# Altium schematic sheet Ups chg.SchDoc
size A4; SheetNumber: 1; SheetTotal: 1
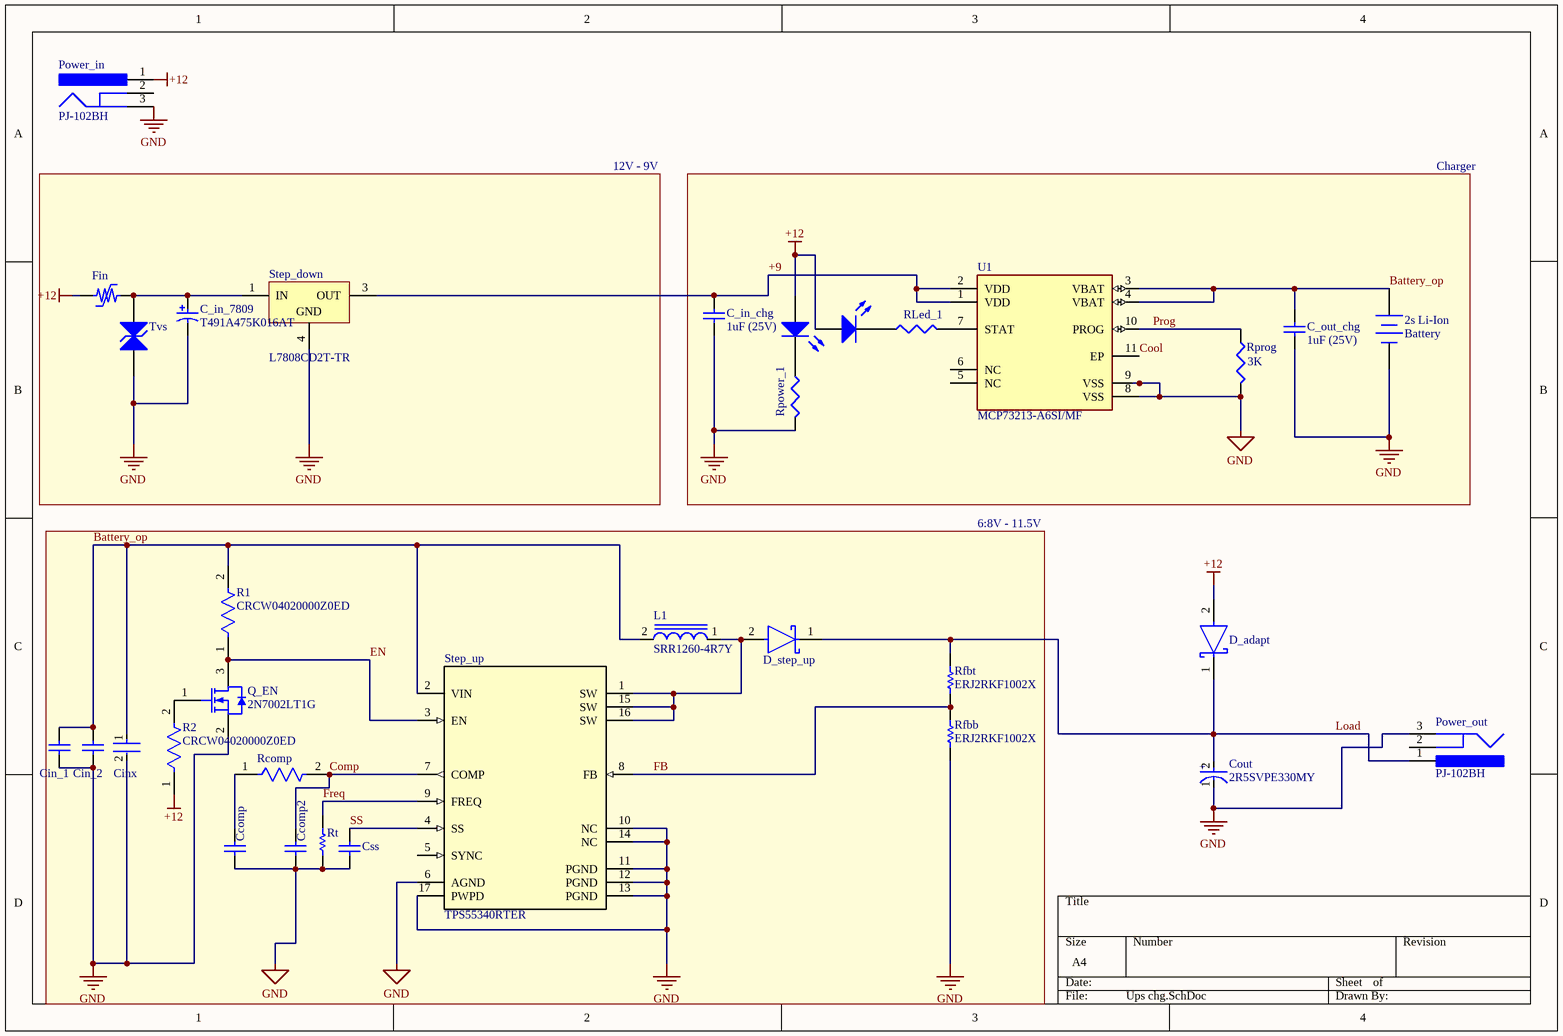
[diagram p0: Ups chg.SchDoc]

## Parts
2s_Li-Ion  Battery  [BAT-2]
C_in_7809  T491A475K016AT  [KEMT-A-3216-18-2_L]
C_in_chg  1uF (25V)  [CAPC2013X140X50LL20T25]
C_out_chg  1uF (25V)  [CAPC2013X140X50LL20T25]
Ccomp  06035C102KAT2A  [CAPC1608X90X35LL15T15]  (value not drawn)
Ccomp2  06035C102KAT2A  [CAPC1608X90X35LL15T15]  (value not drawn)
Cin_1  C1206C106K4RACTU  [CAPC3216X180X50ML20T25]  (value not drawn)
Cin_2  C1206C106K4RACTU  [CAPC3216X180X50ML20T25]  (value not drawn)
Cinx  C0805C104M5RACTU  [FP-C0805C-DN-MFG]  (value not drawn)
Cout  2R5SVPE330MY  [FP-SVPE-B6-MFG]
Css  06035C102KAT2A  [CAPC1608X90X35LL15T15]  (value not drawn)
D_adapt  B540C-13-F  [FP-SMC-MFG]  (value not drawn)
D_chg  LED1  [LED-1]  (value not drawn)
D_step_up  B540C-13-F  [FP-SMC-MFG]  (value not drawn)
Fin  MF-MSMF075-2  [BOUR-MF-MSMF050-2_V]  (value not drawn)
L1  SRR1260-4R7Y  [INDP125125X600N]
Power_Good  LED1  [LED-1]  (value not drawn)
Power_in  PJ-102BH  [CUI-PJ-102BH_V]
Power_out  PJ-102BH  [CUI-PJ-102BH_V]
Q_EN  2N7002LT1G  [ONSC-SOT-23-3-318-08_V]
R1  CRCW04020000Z0ED  [FP-CRCW0402-e3-IPC_C]
R2  CRCW04020000Z0ED  [FP-CRCW0402-e3-IPC_C]
Rcomp  CRCW04020000Z0ED  [FP-CRCW0402-e3-IPC_C]  (value not drawn)
Rfbb  ERJ2RKF1002X  [RESC1005X40X25LL05T05]
Rfbt  ERJ2RKF1002X  [RESC1005X40X25LL05T05]
RLed_1  1K  [J1-0603]  (value not drawn)
Rpower_1  1K  [J1-0603]  (value not drawn)
Rprog  3K  [J1-0603]
Rt  CRCW08050000Z0EA  [RESC2013X50X30LL20T20]  (value not drawn)
Step_down  L7808CD2T-TR  [TO-263_N]
Step_up  TPS55340RTER  [RTE0016C]
Tvs  SMAJ14CA-E3/61  [VISH-DO-214AC-2_N]  (value not drawn)
U1  MCP73213-A6SI/MF  [FP-C04-063-MFG]

## Blocks framed on the sheet
12V - 9V: C_in_7809 Fin Step_down Tvs
Charger: 2s_Li-Ion C_in_chg C_out_chg D_chg Power_Good RLed_1 Rpower_1 Rprog U1
6:8V - 11.5V: Ccomp Ccomp2 Cin_1 Cin_2 Cinx Css D_step_up L1 Q_EN R1 R2 Rcomp Rfbb Rfbt Rt Step_up

## Nets
+12: D_adapt.2(A) D_chg.1(A) Fin.1 Power_Good.1(A) Power_in.1 R2.1
GND: 2s_Li-Ion.2(-) C_in_7809.2 C_in_chg.1 C_out_chg.1 Ccomp.1 Ccomp2.1 Cin_1.1 Cin_2.1 Cinx.2 Cout.1(C) Css.1 Power_in.3 Power_out.3 Q_EN.2(S) Rfbb.1 Rpower_1.2 Rprog.2 Rt.1 Step_down.4(GND) Step_up.6(AGND) Step_up.10(NC) Step_up.11(PGND) Step_up.12(PGND) Step_up.13(PGND) Step_up.14(NC) Step_up.17(PWPD) Tvs.1(A1) U1.8(VSS) U1.9(VSS)
+9: C_in_chg.2 Step_down.3(OUT) U1.1(VDD) U1.2(VDD)
Battery_op: 2s_Li-Ion.1(+) C_out_chg.2 Cin_1.2 Cin_2.2 Cinx.1 L1.2 R1.2 Step_up.2(VIN) U1.3(VBAT) U1.4(VBAT)
Comp: Ccomp2.2 Rcomp.2 Step_up.7(COMP)
Cool: U1.11(EP)
EN: Q_EN.3(D) R1.1 Step_up.3(EN)
FB: Rfbb.2 Rfbt.1 Step_up.8(FB)
Freq: Rt.2 Step_up.9(FREQ)
Load: Cout.2(A) D_adapt.1(C) D_step_up.1(C) Power_out.1 Rfbt.2
Prog: Rprog.1 U1.10(PROG)
SS: Css.2 Step_up.4(SS)
NetC_in_7809_1: C_in_7809.1 Fin.2 Step_down.1(IN) Tvs.2(A2)
NetCcomp_2: Ccomp.2 Rcomp.1
NetD_chg_2: D_chg.2(K) RLed_1.1
NetD_step_up_2: D_step_up.2(A) L1.1 Step_up.1(SW) Step_up.15(SW) Step_up.16(SW)
NetPower_Good_2: Power_Good.2(K) Rpower_1.1
NetQ_EN_1: Q_EN.1(G) R2.2
NetRLed_1_2: RLed_1.2 U1.7(STAT)

Not connected (* = marked no-connect by the designer): Power_in 2; Power_out 2; Step_up 5(SYNC); U1 5(NC) 6(NC)

## Notes on the sheet
- (in symbol CMP-05428-000004-1) +

## Library data of the parts
2s_Li-Ion = Battery: Multicell Battery; Published: 24-Mar-1999; LatestRevisionDate: 17-Jul-2002; LatestRevisionNote: Re-released for DXP Platform.; PackageReference: BAT-2; Publisher: Altium Limited; PackageDescription: Battery; 2 Leads
C_in_7809 = CMP-2000-07188-1: Tantalum Capacitor, 4.7 uF, +/- 10%, 16 V, -55 to 125 degC, 2-Pin Molded, RoHS, Tape and Reel; Manufacturer: Kemet; Capacity (elec.): 4.7µF; Nominal voltage: 16V; Content: 1pc(s); Type: T491A475K016AT; Tolerance: 10%; Mounting Technology: SurfaceMount; Package Reference: 1206; Datasheet URL: https://datasheet.ciiva.com/11793/0900766b80718482-11793043.pdf; Manufacturer URL: http://www.kemet.com/; Package Description: 2-Pin Surface Mount Device, Body 3.2 x 1.6 mm; Category: Tantalumcapacitor; Datasheet Version: 08/2014
C_in_chg C_out_chg = CMP-2007-03234-1: Part Number: C0805C105K3RACTU; Manufacturer: Kemet
Ccomp Ccomp2 Css = CMP-2006-04378-1: Manufacturer: AVX Interconnect / Elco; Part Number: 06035C102KAT2A
Cin_1 Cin_2 = CMP-1664-00006-1: CAP, Ceramic, 10 uF, +/- 10%, 16 V, -55 to 125 degC, 1206 (3216 Metric), RoHS, Tape and Reel; Voltage Rating: 50 V; Case\Package: 0603; Type (Capacitors): C0G; Tolerance: 5%; Capacitance: 8.2 pF; Length: 1.6 mm; Mount: Surface Mount; Radiation Hardening: No; Height: 0.8 mm; RoHSCompliant: true; ComponentLink1URL: http://www.kemet.com/; REACH SVHC: No SVHC; ComponentLink1Description: Manufacturer URL; ComponentLink2Description: Datasheet; ComponentLink2URL: http://capacitoredge.kemet.com/capedge2/DataSheet/Datasheet-C1206C106K4RACTU.pdf?pn=C1206C106K4RACTU; Width: 0.8 mm; Packaging: Tape and Reel; Min Operating Temperature: -55 degC; Voltage Rating (DC): 50 V; Pins: 2; Max Operating Temperature: 125 degC; Case Code (Imperial): 0603; PackageDescription: 2-Pin Surface Mount Device, Body 3.2 x 1.6 mm; DatasheetVersion: Aug-16; Package Quantity: 4000; PackageReference: 1206; Case Code (Metric): 1608
Cinx = CMP-1036-04423-3: CAP CER 0.1UF 50V X7R 0805; Manufacturer: KEMET; Tolerance: 0.2; Temperature Coefficient: 30ppm/°C; Capacitance: 0.10 μF; Value: 0.10 μF; Temperature: -55°C to +125°C; RoHS: TRUE; Temperature Range Low: -55°C; Device Class L3: Ceramic Capacitors; Manufacturer Part Number: C0805C104M5RACTU; Octopart: https://octopart.com/c0805c104m5ractu-kemet-129379; Ipc Land Pattern Name: CAPC200125X78; Mouser Description: Multilayer Ceramic Capacitors MLCC - SMD/SMT 50volts 0.1uF X7R 20%; Temperature Range High: +125°C; Material: Ceramic; Package: C0805C-DN; Temperature Characteristic: X7R; Automotive: No; ComponentLink2URL: https://content.kemet.com/datasheets/KEM_C1003_C0G_SMD.pdf; Device Class L1: Passive Components; ComponentLink2Description: Datasheet; Device Class L2: Capacitors; Voltage Rating: 50 V; Digikey Description: CAP CER 0.1UF 50V X7R 0805; Lead Free: Yes; Height: 0.88mm; Category: Cap
Cout = CMP-05428-000004-1: CAP ALUM POLY 330UF 20% 2.5V SMD; Manufacturer: Panasonic; Leakage Current: 500uA; Dissipation Factor: 12%; Esr: 10mΩ; Life: 2000Hours; Ripple Current: 3860mA; Height: 6mm; Mouser Description: Cap Aluminum Polymer 330uF 2.5VDC 20% (5 X 5.9mm) SMD 0.01 Ohm 3860mA 2000h 105C T/R; ComponentLink2Description: Datasheet; Material: Polymer; Category: Cap; Device Class L3: Polymer Capacitors; Footprint Url: https://industrial.panasonic.com/cdbs/www-data/pdf/AAB8000/AAB8000COL10.pdf; Package: SVPE-B6; ComponentLink2URL: https://industrial.panasonic.com/cdbs/www-data/pdf/AAB8000/AAB8000C179.pdf; Value: 330uF; Temperature: -55°C to +105°C; Octopart: https://octopart.com/2r5svpe330my-panasonic-29498404; Temperature Range High: +105°C; Automotive: No; Device Class L2: Capacitors; Tolerance: 20%; Manufacturer Part Number: 2R5SVPE330MY; Digikey Description: CAP ALUM POLY 330UF 20% 2.5V SMD; Device Class L1: Passive Components; Voltage Rating: 2.5V; Capacitance: 330uF; Lead Free: Yes; RoHS: TRUE; Temperature Range Low: -55°C
D_adapt D_step_up = CMP-2000-05097-3: DIODE SCHOTTKY 40V 5A SMC; Manufacturer: Diodes Inc.; Automotive Grade: NA; Peak Reverse Current: 0.5mA; Value: 300pF; Max Junction Temp: +150°C; Max Surge Forward Current: 100A; Standoff Height: 0.1mm; Digikey Description: DIODE SCHOTTKY 40V 5A SMC; Temperature Range Low: -55°C; Manufacturer Part Number: B540C-13-F; Octopart: https://octopart.com/b540c-13-f-diodes+inc.-325873; Lead Free: Yes; Reverse Voltage: 40V; RoHS: TRUE; Category: Diode; Mouser Description: Diode: Schottky rectifying; SMD; 40V; 5A; SMC; Package: reel, tape; ComponentLink2Description: Datasheet; Temperature Range High: +150°C; Automotive: No; Footprint Url: https://www.diodes.com/assets/Package-Files/SMC.pdf; Device Class L3: Schottky Diodes; Height: 2.5mm; Forward Current: 5A; Temperature: -55°C to +150°C; Package: SMC; ComponentLink2URL: https://www.diodes.com/assets/Datasheets/ds13012.pdf; Device Class L2: Diodes; Max Repetitive Reverse Voltage: 40V; Device Class L1: Discrete Semiconductors; Capacitance: 300pF
D_chg Power_Good = LED1: Typical RED GaAs LED; Published: 8-Jun-2000; LatestRevisionDate: 08-Jul-2005; LatestRevisionNote: Mech Layer 1 removed.; PackageReference: LED-1; Publisher: Altium Limited; PackageDescription: LED; 2 Leads
Fin = CMP-2100-03654-1: PTC Resettable Fuse, 13.2 V, 750 mA, -40 to 85 degC, 2-Pin SMD, RoHS, Tape and Reel; Manufacturer: Bourns; Voltage Rating: 13.2V; Resistance: 450mOhm; Max Current Rating: 100A; Power Dissipation: 800mW; RoHSCompliant: true; Package Quantity: 2000; Manufacturer URL: http://www.bourns.com/; Max Operating Temperature: 85degC; Datasheet URL: http://www.bourns.com/docs/Product-Datasheets/mfmsmf.pdf; Mount: SurfaceMount; Case Code (Imperial): 1812; Width: 3.41mm; REACH SVHC: NoSVHC; Datasheet Version: Rev. AG, 08/2016; Packaging: TapeandReel; Lead Free: LeadFree; Height: 0.85mm; Current Rating: 100A; Min Operating Temperature: -40degC; Voltage Rating (DC): 13.2V; Case/Package: 1812; Termination: SMD/SMT; Radiation Hardening: No; Case Code (Metric): 4532; Supply Voltage: 13.2V; Package Reference: MF-MSMF050-2; Number of Terminals: 2; Length: 4.73mm; Package Description: 2-Pin Surface Mount Device, Body 4.55 x 3.24 mm
L1 = SRR1260-4R7Y: 4.7ÂµH Shielded Wirewound Inductor 6.8A 15.5mOhm Max Nonstandard; MF: Bourns; MP: SRR1260-4R7Y; Purchase-URL: https://pricing.snapeda.com/search/part/SRR1260-4R7Y/?ref=eda; SnapEDA_Link: https://www.snapeda.com/parts/SRR1260-4R7Y/Bourns/view-part/587861/?ref=snap; Price: None; Package: Nonstandard Bourns; Value: *; Check_prices: https://www.snapeda.com/parts/SRR1260-4R7Y/Bourns/view-part/587861/?ref=eda; Availability: Warning
Power_in Power_out = CMP-2000-06901-1: Through Hole Right Angle DC Power Jack, 5 A, 2.5 mm Center Pin, 3 Position, -25 to 85 degC, RoHS, Bulk; Manufacturer: CUIInc.; Outside Contact Diameter: 6.5mm; Current Rating: 5A; Brand: CUI; Insulation Resistance: 100MOhms; Inside Contact Diameter: 2.5mm; Voltage Rating: 24V; Operating Temperature Range: -25Cto+85C; Mounting Angle: Right; Mounting Technology: ThroughHole; Product Category: DCPowerConnectors; Datasheet Version: Rev. 1.02, 05/2016; Connector Type: DCPowerJack; Contact Material: Copper; Housing Material: PolybutyleneTerephthalate(PBT); Mounting Style: ThroughHole; Product: Jacks; Package Reference: PJ-102BH; Manufacturer URL: http://www.cui.com/; RoHS: True; Contact Gender: Male; Contact Plating: Nickel; Flammability Rating: UL94V-0; Factory Pack Quantity: 280; Datasheet URL: http://www.cui.com/product/resource/pj-102bh.pdf; Package Description: 3-Pin Through Hole Device, Body 14.4 x 9 mm, Height 11 mm; Termination Style: ThroughHole
Q_EN = CMP-1058-00781-1: Small Signal MOSFET, 60 V, 115 mA, N-Channel, 3-Pin SOT-23, Pb-Free, Tape and Reel; Manufacturer: On Semiconductor; Channel Polarity: N Channel; V(BR)DSS Min (V): 60; ID Max (A): 0.115; VGS Max (V): 20; Configuration: Single; VGS(th) Max (V): 2.5; ComponentLink1URL: http://www.onsemi.com/; ComponentLink3Description: Package Specification; ComponentLink3URL: http://www.onsemi.cn/pub_link/Collateral/318-08.PDF; PackageReference: SOT-23-3-318-08; RoHS: Pb-Free; ComponentLink2URL: http://www.onsemi.com/pub_link/Collateral/2N7002L-D.PDF; ComponentLink1Description: Manufacturer URL; Package Type: SOT-23-3; Packing: Tape and Reel; PartNumber: 2N7002LT1G; DatasheetVersion: Rev. 7; Mounting Technology: Surface Mount; ComponentLink2Description: Datasheet; PackageDescription: 3-Pin Small Outline Transistor, Body 2.92 x 1.3 mm, Pitch 0.95 mm; PackageVersion: Rev. AP, 11/2009
R1 R2 Rcomp = CMP-2002-08122-2: RES Thick Film, 0Ω, 0.063W, 0402; Tolerance: 5%; Max Power Dissipation: 63mW; Voltage Rating: 50V; Temperature Coefficient: 100ppm/°C; Resistance: 0mR; Contact Plating: Tin; Height: 0.35mm; Radiation Hardening: No; Features: Automotive AEC-Q200; Composition: Thick Film; Width: 0.5mm; Weight: 2.3E-05oz; Termination: SMD/SMT; Packaging: Tape and Reel; Mount: Surface Mount; Case Code (Metric): 1005; Military Standard: Not; Min Operating Temperature: -55°C; Number of Terminations: 2; Package Quantity: 1; Case Code (Imperial): 0402; Depth: 0.5mm; Max Operating Temperature: 155°C; Case/Package: 0402; Power Rating: 63mW; Lead Free: Lead Free; Voltage Rating (DC): 50V; Length: 1mm
Rfbb Rfbt = CMP-2000-07588-1: Chip Resistor, 10 KOhm, +/- 1%, 0.1 W, -55 to 155 degC, 0402 (1005 Metric), RoHS, Tape and Reel; Manufacturer: Panasonic; Power Rating: 100mW; Voltage Rating: 50V; Resistance: 10KOhm; Case\/Package: 0402; Temperature Coefficient: 100ppm\/degreesC; RoHSCompliant: True; Lead Free: LeadFree; Package Quantity: 1; Contact Plating: Tin; Length: 1mm; Radiation Hardening: No; REACH SVHC: NoSVHC; Max Operating Temperature: 155degC; Depth: 0.5mm; Case Code (Imperial): 0402; Military Standard: Not; Package Description: 2-Pin Surface Mount Device, Body 1 x 0.5 mm; Termination: SMD/SMT; Case Code (Metric): 1005; Height: 0.35mm; Packaging: TapeandReel; Voltage Rating (DC): 50V; Package Reference: 402; Number of Pins: 2; Tolerance: 1%; Mounting Technology: SurfaceMount; Width: 0.02inch; Mount: SurfaceMount; Datasheet URL: https://industrial.panasonic.com/cdbs/www-data/pdf/RDA0000/AOA0000C304.pdf; Composition: ThickFilm; Datasheet Version: 02/2017; Manufacturer URL: http://www.panasonic.com/; Max Power Dissipation: 100mW; Number of Terminations: 2; Min Operating Temperature: -55degC
RLed_1 Rpower_1 = Res3: Resistor; Published: 8-Jun-2000; LatestRevisionDate: 29-May-2009; LatestRevisionNote: IPC-7351 Footprint Added.; PackageReference: J1-0603; Publisher: Altium Limited; PackageDescription: Chip Resistor; Value: 1K
Rprog = Res3: Resistor; Value: 1K; Published: 8-Jun-2000; LatestRevisionDate: 29-May-2009; LatestRevisionNote: IPC-7351 Footprint Added.; PackageReference: J1-0603; Publisher: Altium Limited; PackageDescription: Chip Resistor
Rt = CMP-2001-04896-1: Manufacturer: Vishay Dale; Part Number: CRCW08050000Z0EA
Step_down = CMP-0244-00209-1: Positive Voltage Regulator, 3-Pin D2PAK, Tape and Reel; PackageVersion: 2011; PackageDescription: 3-Pin Transistor Outline Package 2.54 mm Pitch, 15.4 mm Lead Span (D2PAK); ComponentLink1URL: http://www.st.com; ComponentLink2URL: http://www.st.com/internet/com/TECHNICAL_RESOURCES/TECHNICAL_LITERATURE/DATASHEET/CD00000444.pdf; DatasheetVersion: 16/11/2011; ComponentLink1Description: Manufacturer URL; ComponentLink2Description: Datasheet; PackageReference: TO-263
Step_up = TPS55340RTER: No Description Available; Manufacturer: Texas Instruments; PartNumber: TPS55340RTER; RefDes: RefDes; Type: DEV; Value: Value; Copyright: Copyright (C) 2018 Accelerated Designs. All rights reserved
Tvs = CMP-0548-00182-2: Transient Voltage Suppressor, 6.40 to 231 V, 14 V Stand-off Voltage, Bi-Directional, -55 to 155 degC, 2-pin DO-214AC, Pb-Free, Tape and Reel; Manufacturer: Vishay Semiconductor; VWM (V): 14; VBR Bi-Directional (V): 6.4 to 231; ID (uA): 2; IFSM: 40 A; PPPM (W): 400, 300; ComponentLink1Description: Manufacturer URL; Operating Junction and Storage Temperature Range: -55 to 150 degC; Packing: Tape and Reel; Mounting Technology: Surface Mount; PartNumber: SMAJ14CA-E3/61; ComponentLink3URL: http://www.vishay.com/docs/88390/smaj50a.pdf; RoHS: TRUE; PackageReference: DO-214AC-2; ComponentLink2URL: http://www.vishay.com/docs/88390/smaj50a.pdf; PackageDescription: 2-Pin DO-214AC (SMA), Body 4.245 x 2.665 mm; ComponentLink1URL: http://www.vishay.com/; DatasheetVersion: 12/8/2013; ComponentLink2Description: Datasheet; ComponentLink3Description: Package Specification
U1 = CMP-0133-00131-2: IC LI-ION/LI-POLY CTRLR 10-DFN; Number of Cells: 2; Max Input Voltage: 18V; Output Voltage: 8.4V; Max Supply Voltage: 13V; Operating Supply Current: 700uA; Drain to Source Resistance: 350mR; Max Output Current: 1.1A; Min Output Voltage: 8.15V; Voltage Rating: 8.85V; Min Supply Voltage: 4.2V; Radiation Hardening: No; Max Operating Temperature: 85°C; Mount: Surface Mount; Height: 0.037inch; REACH SVHC: No SVHC; Max Charge Current: 1.1A; Packaging: Rail/Tube; Number of Pins: 10; Package Quantity: 120; Case/Package: DFN; Max Output Voltage: 8.85V; Min Operating Temperature: -40°C; Length: 0.118inch; Number of Channels: 2; Width: 0.118inch; Lead Free: Lead Free